# EAGLE schematic canSlaveV06 (EAGLE 7.1.0)

## Sheet 1 of 6
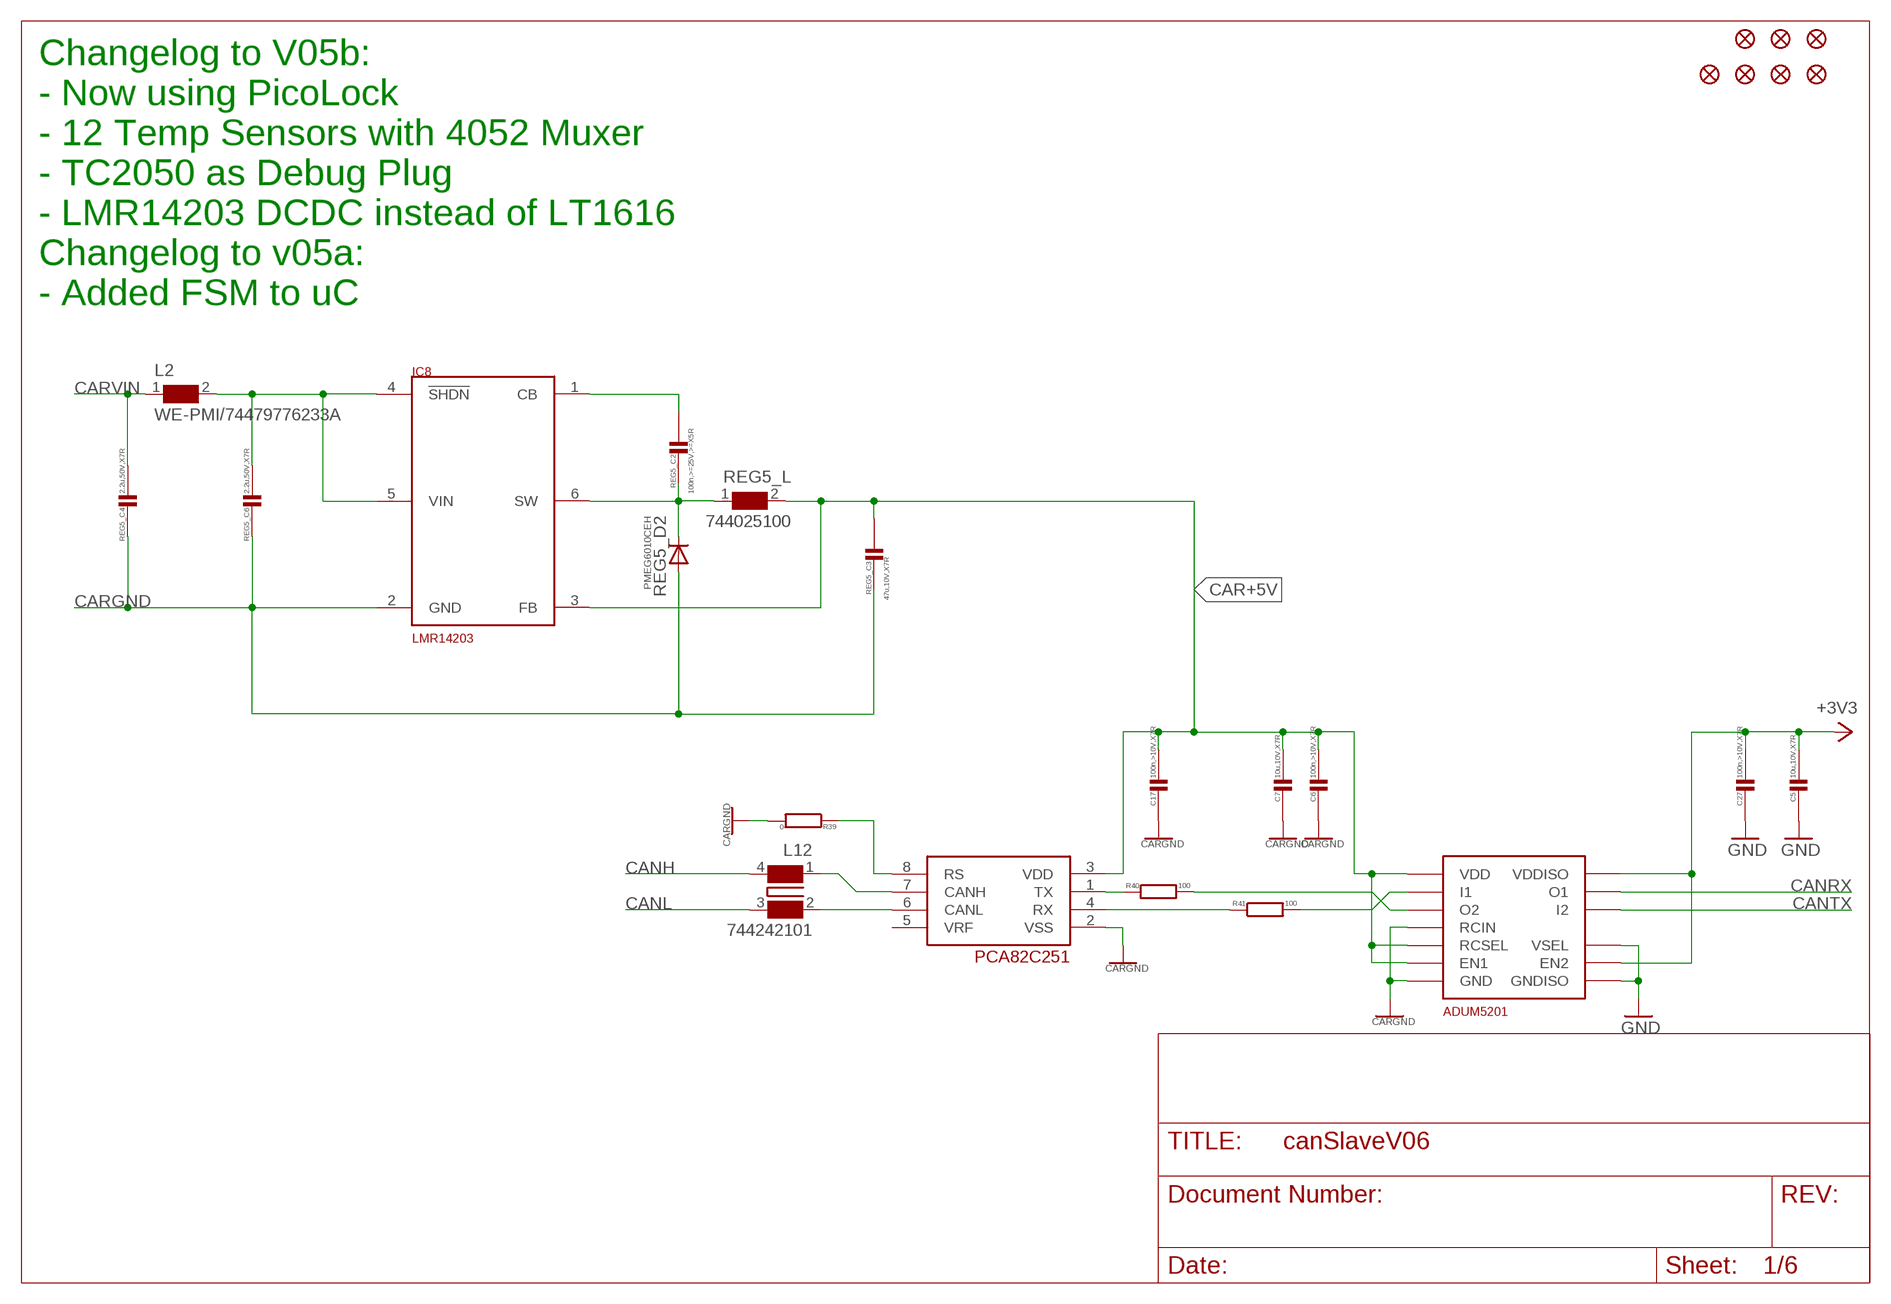
[diagram p0: schematic, sheet 1]

### Parts
C5  10u,10V,X7R  C0603  [C0603]
C6  100n,>10V,X7R  C0402  [C0402]
C7  10u,10V,X7R  C0603  [C0603]
C17  100n,>10V,X7R  C0402  [C0402]
C27  100n,>10V,X7R  C0402  [C0402]
FID2  FIDUCIAL""  [FIDUCIAL_1MM]
FID3  FIDUCIAL""  [FIDUCIAL_1MM]
FID4  FIDUCIAL""  [FIDUCIAL_1MM]
FID7  FIDUCIAL""  [FIDUCIAL_1MM]
FID8  FIDUCIAL""  [FIDUCIAL_1MM]
FID9  FIDUCIAL""  [FIDUCIAL_1MM]
FID10  FIDUCIAL""  [FIDUCIAL_1MM]
IC4  PCA82C251  MCP2551  [SO-8]
IC5  ADUM5201  [SO16WB]
IC8  LMR14203  LMR1420X  [SOT23-6]
L2  WE-PMI/74479776233A  WE-PMI_0806  [WE-PMI_0806]
L12  744242101  WE-SLM  [WE-SLM]
R39  0  R0402  [R0402]
R40  100  R0402  [R0402]
R41  100  R0402  [R0402]
REG5_C2  100n,>=25V,>=X5R  C0402  [C0402]
REG5_C3  47u,10V,X7R  C1210  [C1210]
REG5_C4  2.2u,50V,X7R  C0805  [C0805]
REG5_C6  2.2u,50V,X7R  C0805  [C0805]
REG5_D2  PMEG6010CEH  D-SOD123  [SOD123]
REG5_L  744025100  WE-TPC_2828  [WE-TPC_2828]

### Nets
+3V3: C5.1 C27.1 IC5.P$10(EN2) IC5.P$16(VDDISO) ; also sheet 2,3,6
BOOST1: IC8.1(CB) REG5_C2.1
CANH: L12.4 ; also sheet 5
CANL: L12.3 ; also sheet 5
CANRX: IC5.P$14(O1) ; also sheet 2
CANTX: IC5.P$13(I2) ; also sheet 2
CAR+5V: C6.1 C7.1 C17.1 IC4.3(VDD) IC5.P$1(VDD) IC5.P$6(RCSEL) IC5.P$7(EN1) IC8.3(FB) REG5_C3.1 REG5_L.2
CAR_CANRX: IC5.P$3(I1) R41.2
CAR_CANRX_T: IC4.4(RX) R41.1
CAR_CANTX: IC5.P$4(O2) R40.2
CAR_CANTX_T: IC4.1(TX) R40.1
CARGND: C6.2 C7.2 C17.2 IC4.2(VSS) IC5.P$2(GND) IC5.P$5(RCIN) IC5.P$8(GND) IC8.2(GND) R39.2 REG5_C3.2 REG5_C4.2 REG5_C6.2 REG5_D2.2(A) ; also sheet 5
CARVIN: L2.1 REG5_C4.1 ; also sheet 5
CARVINFILT: IC8.4(!SHDN) IC8.5(VIN) L2.2 REG5_C6.1
GND: C5.2 C27.2 IC5.P$9(GNDISO) IC5.P$11(VSEL) IC5.P$15(GNDISO) ; also sheet 2,3,5,6
N$2: IC4.7(CANH) L12.1
N$6: IC4.6(CANL) L12.2
RS1: IC4.8(RS) R39.1
SW1: IC8.6(SW) REG5_C2.2 REG5_D2.1(C) REG5_L.1
Unconnected: IC4.5(VRF)

### Notes on the sheet
- Changelog to V05b:
  - Now using PicoLock
  - 12 Temp Sensors with 4052 Muxer
  - TC2050 as Debug Plug
  - LMR14203 DCDC instead of LT1616
  Changelog to v05a:
  - Added FSM to uC

## Sheet 2 of 6
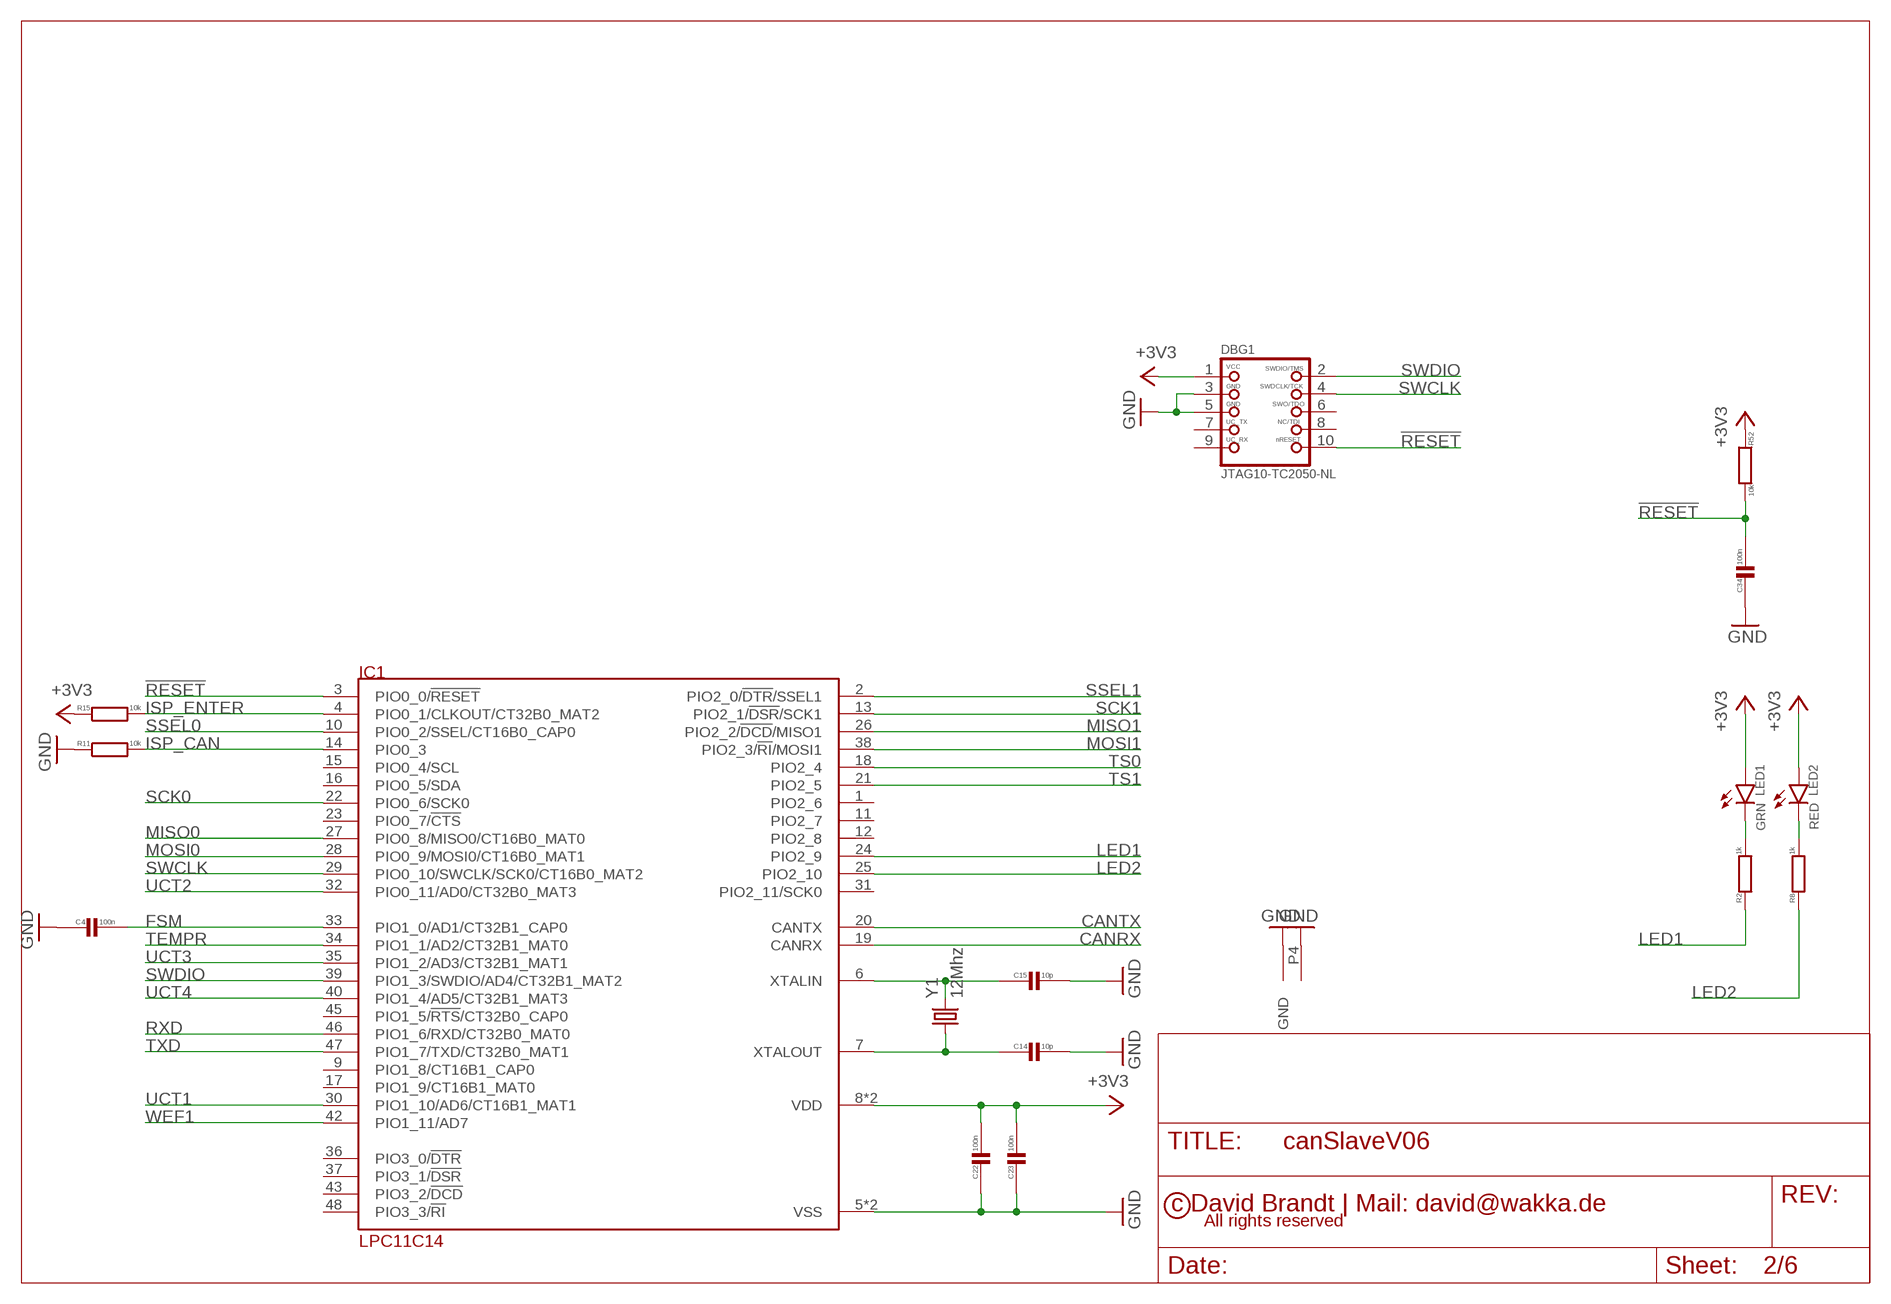
[diagram p1: schematic, sheet 2]

### Parts
C4  100n  C0402  [C0402]
C14  10p  C0402  [C0402]
C15  10p  C0402  [C0402]
C22  100n  C0402  [C0402]
C23  100n  C0402  [C0402]
C34  100n  C0402  [C0402]
DBG1  JTAG10-TC2050-NL  [TC2050-NL-JTORDER]
IC1  LPC11C14  LPC11C1X  [LQFP48]
LED1  GRN  LED0603  [CHIPLED_0603]
LED2  RED  LED0603  [CHIPLED_0603]
R2  1k  R0402  [R0402]
R8  1k  R0402  [R0402]
R11  10k  R0402  [R0402]
R15  10k  R0402  [R0402]
R52  10k  R0402  [R0402]
Y1  12Mhz  CRYSTAL43.2X2.5  [MT]

### Nets
!RESET: C34.1 DBG1.10 IC1.3(PIO0_0/!RESET) R52.2
+3V3: C22.1 C23.1 DBG1.1 IC1.8(VDD) IC1.44(VDD) LED1.A LED2.A R15.1 R52.1 ; also sheet 1,3,6
CANRX: IC1.19(CANRX) ; also sheet 1
CANTX: IC1.20(CANTX) ; also sheet 1
FSM: C4.1 IC1.33(PIO1_0/AD1/CT32B1_CAP0) ; also sheet 3
GND: C4.2 C14.1 C15.1 C22.2 C23.2 C34.2 DBG1.3 DBG1.5 IC1.5(VSS) IC1.41(VSS) R11.1 Y1.P2(GND) Y1.P4(GND1) ; also sheet 1,3,5,6
ISP_CAN: IC1.14(PIO0_3) R11.2
ISP_ENTER: IC1.4(PIO0_1/CLKOUT/CT32B0_MAT2) R15.2
LED1: IC1.24(PIO2_9) R2.1
LED1C: LED1.C R2.2
LED2: IC1.25(PIO2_10) R8.1
LED2C: LED2.C R8.2
MISO0: IC1.27(PIO0_8/MISO0/CT16B0_MAT0) ; also sheet 3
MISO1: IC1.26(PIO2_2/!DCD!/MISO1)
MOSI0: IC1.28(PIO0_9/MOSI0/CT16B0_MAT1) ; also sheet 3
MOSI1: IC1.38(PIO2_3/!RI!/MOSI1)
RXD: IC1.46(PIO1_6/RXD/CT32B0_MAT0)
SCK0: IC1.22(PIO0_6/SCK0) ; also sheet 3
SCK1: IC1.13(PIO2_1/!DSR!/SCK1)
SSEL0: IC1.10(PIO0_2/SSEL/CT16B0_CAP0) ; also sheet 3
SSEL1: IC1.2(PIO2_0/!DTR!/SSEL1)
SWCLK: DBG1.4 IC1.29(PIO0_10/SWCLK/SCK0/CT16B0_MAT2)
SWDIO: DBG1.2 IC1.39(PIO1_3/SWDIO/AD4/CT32B1_MAT2)
TEMPR: IC1.34(PIO1_1/AD2/CT32B1_MAT0) ; also sheet 3
TS0: IC1.18(PIO2_4) ; also sheet 6
TS1: IC1.21(PIO2_5) ; also sheet 6
TXD: IC1.47(PIO1_7/TXD/CT32B0_MAT1)
UCT1: IC1.30(PIO1_10/AD6/CT16B1_MAT1) ; also sheet 6
UCT2: IC1.32(PIO0_11/AD0/CT32B0_MAT3) ; also sheet 6
UCT3: IC1.35(PIO1_2/AD3/CT32B1_MAT1) ; also sheet 6
UCT4: IC1.40(PIO1_4/AD5/CT32B1_MAT3) ; also sheet 6
WEF1: IC1.42(PIO1_11/AD7)
XTALIN: C15.2 IC1.6(XTALIN) Y1.P3
XTALOUT: C14.2 IC1.7(XTALOUT) Y1.P1
Unconnected: DBG1.6 DBG1.7 DBG1.8 DBG1.9 IC1.1(PIO2_6) IC1.9(PIO1_8/CT16B1_CAP0) IC1.11(PIO2_7) IC1.12(PIO2_8) IC1.15(PIO0_4/SCL) IC1.16(PIO0_5/SDA) IC1.17(PIO1_9/CT16B1_MAT0) IC1.23(PIO0_7/!CTS) IC1.31(PIO2_11/SCK0) IC1.36(PIO3_0/!DTR) IC1.37(PIO3_1/!DSR) IC1.43(PIO3_2/!DCD) IC1.45(PIO1_5/!RTS!/CT32B0_CAP0) IC1.48(PIO3_3/!RI)

## Sheet 3 of 6
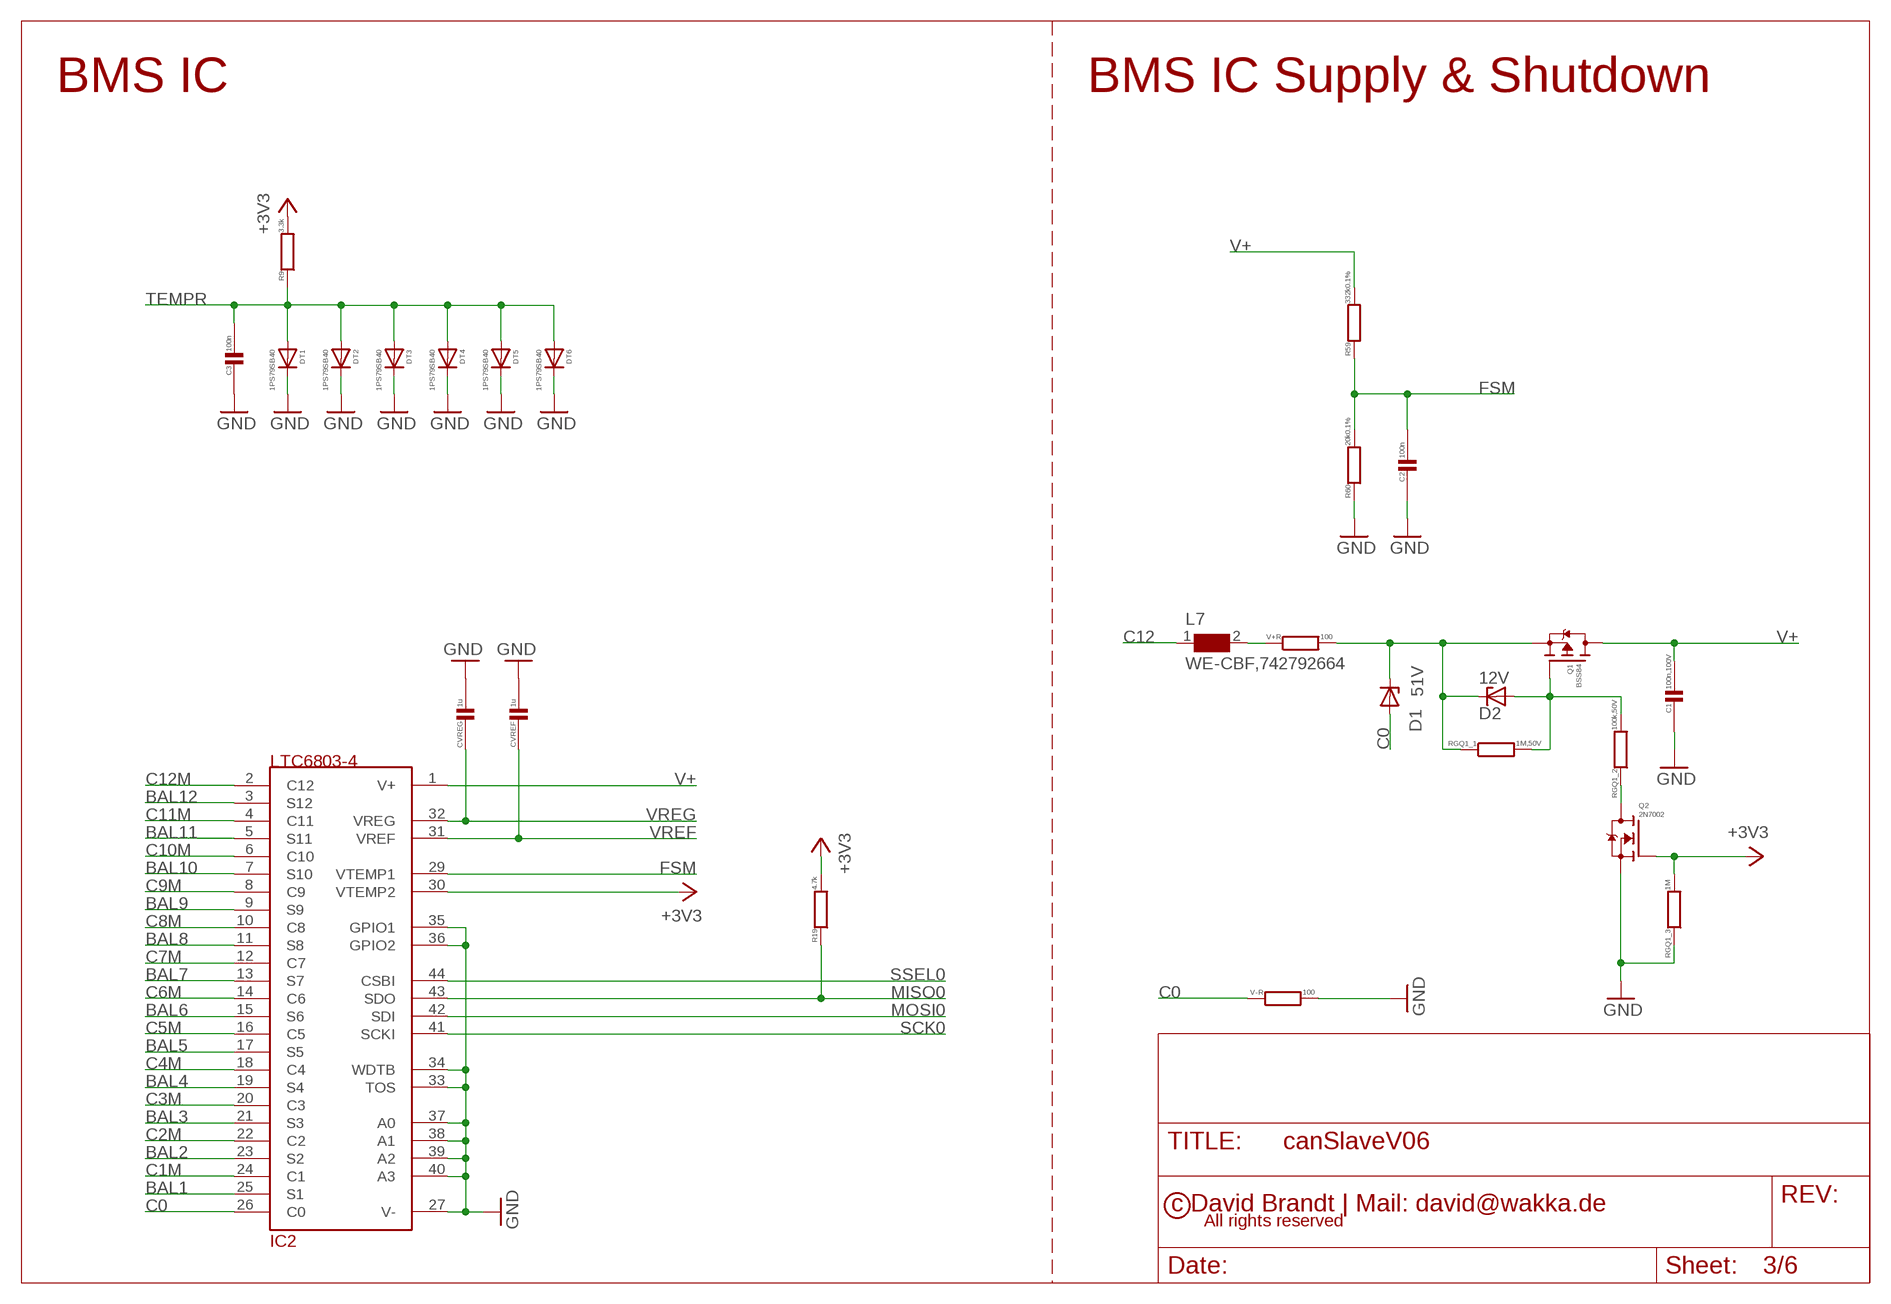
[diagram p2: schematic, sheet 3]

### Parts
C1  100n,100V  C0603  [C0603]
C2  100n  C0402  [C0402]
C3  100n  C0402  [C0402]
CVREF  1u  C0402  [C0402]
CVREG  1u  C0402  [C0402]
D1  51V  ZENERSOD323  [SOD323-L]
D2  12V  ZENERSOD323  [SOD323-L]
DT1  1PS79SB40  DIODE-SOD523  [SOD523]
DT2  1PS79SB40  DIODE-SOD523  [SOD523]
DT3  1PS79SB40  DIODE-SOD523  [SOD523]
DT4  1PS79SB40  DIODE-SOD523  [SOD523]
DT5  1PS79SB40  DIODE-SOD523  [SOD523]
DT6  1PS79SB40  DIODE-SOD523  [SOD523]
IC2  LTC6803-4  [44SSOP]
L7  WE-CBF,742792664  WE-CBF_0603  [0603]
Q1  BSS84  [SOT23]
Q2  2N7002  [SOT23]
R9  3.3k  R0603  [R0603]
R19  4.7k  R0402  [R0402]
R59  332k0.1%  R0603  [R0603]
R60  20k0.1%  R0402  [R0402]
RGQ1_1  1M,50V  R0603  [R0603]
RGQ1_2  100k,50V  R0603  [R0603]
RGQ1_3  1M  R0402  [R0402]
V+R  100  R0603  [R0603]
V-R  100  R0603  [R0603]

### Nets
+3V3: IC2.30(VTEMP2) Q2.1(G) R9.2 R19.2 RGQ1_3.2 ; also sheet 1,2,6
BAL1: IC2.25(S1) ; also sheet 4
BAL2: IC2.23(S2) ; also sheet 4
BAL3: IC2.21(S3) ; also sheet 4
BAL4: IC2.19(S4) ; also sheet 4
BAL5: IC2.17(S5) ; also sheet 4
BAL6: IC2.15(S6) ; also sheet 4
BAL7: IC2.13(S7) ; also sheet 4
BAL8: IC2.11(S8) ; also sheet 4
BAL9: IC2.9(S9) ; also sheet 4
BAL10: IC2.7(S10) ; also sheet 4
BAL11: IC2.5(S11) ; also sheet 4
BAL12: IC2.3(S12) ; also sheet 4
C0: D1.A IC2.26(C0) V-R.1 ; also sheet 4,5
C1M: IC2.24(C1) ; also sheet 4
C2M: IC2.22(C2) ; also sheet 4
C3M: IC2.20(C3) ; also sheet 4
C4M: IC2.18(C4) ; also sheet 4
C5M: IC2.16(C5) ; also sheet 4
C6M: IC2.14(C6) ; also sheet 4
C7M: IC2.12(C7) ; also sheet 4
C8M: IC2.10(C8) ; also sheet 4
C9M: IC2.8(C9) ; also sheet 4
C10M: IC2.6(C10) ; also sheet 4
C11M: IC2.4(C11) ; also sheet 4
C12: L7.1 ; also sheet 4,5
C12FILT: L7.2 V+R.1
C12M: IC2.2(C12) ; also sheet 4
FSM: C2.1 IC2.29(VTEMP1) R59.1 R60.2 ; also sheet 2
GND: C1.2 C2.2 C3.2 CVREF.1 CVREG.1 DT1.C DT2.C DT3.C DT4.C DT5.C DT6.C IC2.27(V-) IC2.33(TOS) IC2.34(WDTB) IC2.35(GPIO1) IC2.36(GPIO2) IC2.37(A0) IC2.38(A1) IC2.39(A2) IC2.40(A3) Q2.2(S) R60.1 RGQ1_3.1 V-R.2 ; also sheet 1,2,5,6
MISO0: IC2.43(SDO) R19.1 ; also sheet 2
MOSI0: IC2.42(SDI) ; also sheet 2
Q1G: D2.A Q1.1(G) RGQ1_1.2 RGQ1_2.2
Q1GR: Q2.3(D) RGQ1_2.1
SCK0: IC2.41(SCKI) ; also sheet 2
SSEL0: IC2.44(CSBI) ; also sheet 2
TEMPR: C3.1 DT1.A DT2.A DT3.A DT4.A DT5.A DT6.A R9.1 ; also sheet 2
V+: C1.1 IC2.1(V+) Q1.3(D) R59.2
V+S: D1.C D2.C Q1.2(S) RGQ1_1.1 V+R.2
VREF: CVREF.2 IC2.31(VREF)
VREG: CVREG.2 IC2.32(VREG)

### Notes on the sheet
- BMS IC | BMS IC Supply & Shutdown

## Sheet 4 of 6
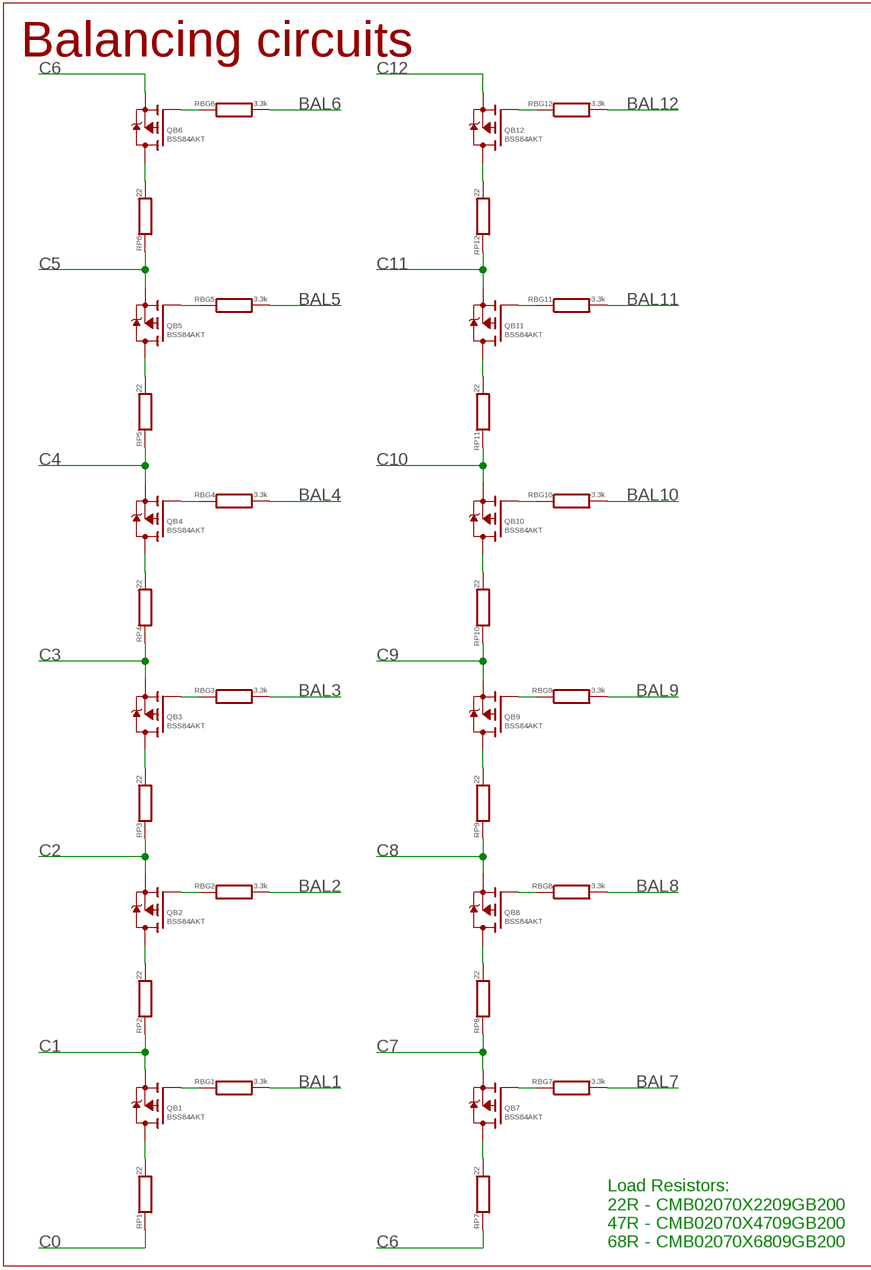
[diagram p3: schematic, sheet 4, part 1 of 2]
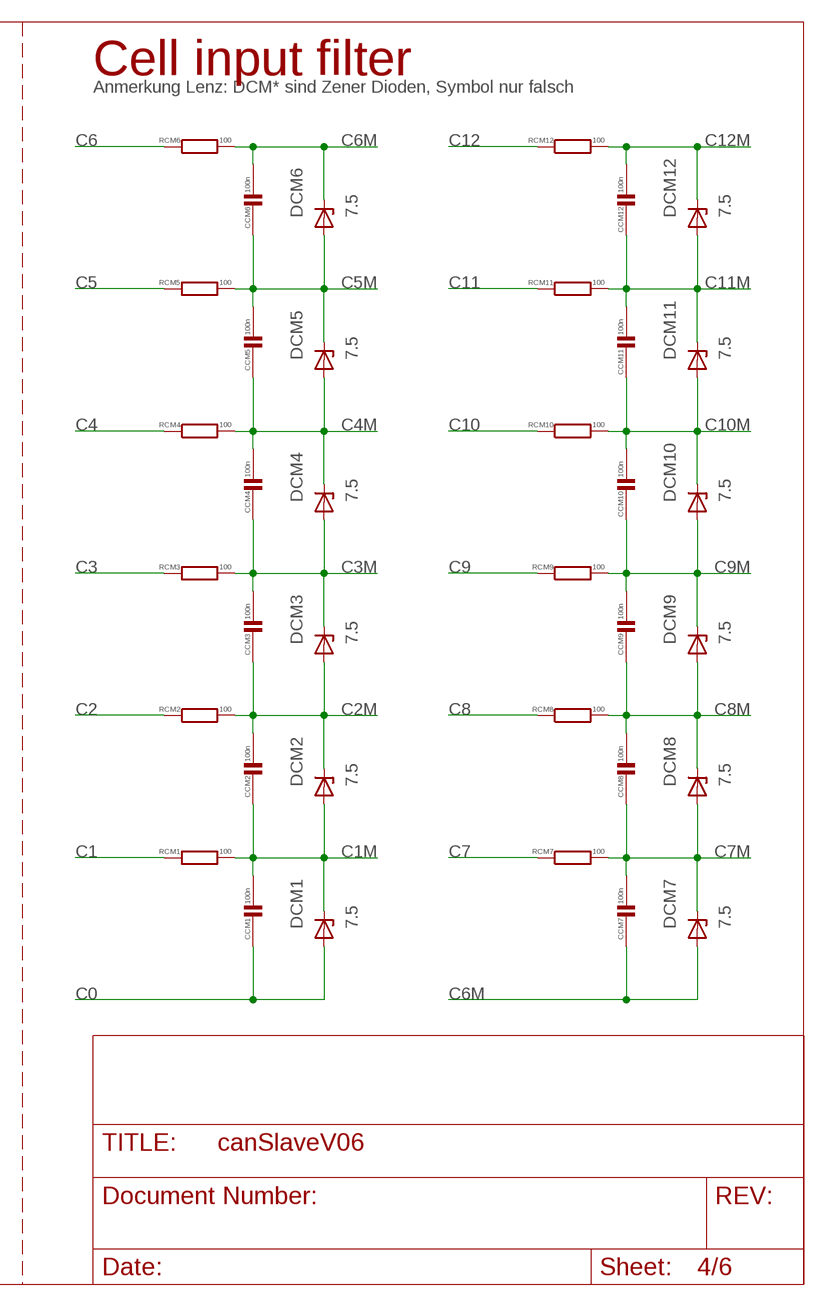
[diagram p4: schematic, sheet 4, part 2 of 2]

### Parts
CCM1  100n  C0402  [C0402]
CCM2  100n  C0402  [C0402]
CCM3  100n  C0402  [C0402]
CCM4  100n  C0402  [C0402]
CCM5  100n  C0402  [C0402]
CCM6  100n  C0402  [C0402]
CCM7  100n  C0402  [C0402]
CCM8  100n  C0402  [C0402]
CCM9  100n  C0402  [C0402]
CCM10  100n  C0402  [C0402]
CCM11  100n  C0402  [C0402]
CCM12  100n  C0402  [C0402]
DCM1  7.5  ZENERSOD523  [SOD523]
DCM2  7.5  ZENERSOD523  [SOD523]
DCM3  7.5  ZENERSOD523  [SOD523]
DCM4  7.5  ZENERSOD523  [SOD523]
DCM5  7.5  ZENERSOD523  [SOD523]
DCM6  7.5  ZENERSOD523  [SOD523]
DCM7  7.5  ZENERSOD523  [SOD523]
DCM8  7.5  ZENERSOD523  [SOD523]
DCM9  7.5  ZENERSOD523  [SOD523]
DCM10  7.5  ZENERSOD523  [SOD523]
DCM11  7.5  ZENERSOD523  [SOD523]
DCM12  7.5  ZENERSOD523  [SOD523]
QB1  BSS84AKT  [SOT416]
QB2  BSS84AKT  [SOT416]
QB3  BSS84AKT  [SOT416]
QB4  BSS84AKT  [SOT416]
QB5  BSS84AKT  [SOT416]
QB6  BSS84AKT  [SOT416]
QB7  BSS84AKT  [SOT416]
QB8  BSS84AKT  [SOT416]
QB9  BSS84AKT  [SOT416]
QB10  BSS84AKT  [SOT416]
QB11  BSS84AKT  [SOT416]
QB12  BSS84AKT  [SOT416]
RBG1  3.3k  R0402  [R0402]
RBG2  3.3k  R0402  [R0402]
RBG3  3.3k  R0402  [R0402]
RBG4  3.3k  R0402  [R0402]
RBG5  3.3k  R0402  [R0402]
RBG6  3.3k  R0402  [R0402]
RBG7  3.3k  R0402  [R0402]
RBG8  3.3k  R0402  [R0402]
RBG9  3.3k  R0402  [R0402]
RBG10  3.3k  R0402  [R0402]
RBG11  3.3k  R0402  [R0402]
RBG12  3.3k  R0402  [R0402]
RCM1  100  R0402  [R0402]
RCM2  100  R0402  [R0402]
RCM3  100  R0402  [R0402]
RCM4  100  R0402  [R0402]
RCM5  100  R0402  [R0402]
RCM6  100  R0402  [R0402]
RCM7  100  R0402  [R0402]
RCM8  100  R0402  [R0402]
RCM9  100  R0402  [R0402]
RCM10  100  R0402  [R0402]
RCM11  100  R0402  [R0402]
RCM12  100  R0402  [R0402]
RP1  22  RMELF-0207R  [MINI_MELF-0207R]
RP2  22  RMELF-0207R  [MINI_MELF-0207R]
RP3  22  RMELF-0207R  [MINI_MELF-0207R]
RP4  22  RMELF-0207R  [MINI_MELF-0207R]
RP5  22  RMELF-0207R  [MINI_MELF-0207R]
RP6  22  RMELF-0207R  [MINI_MELF-0207R]
RP7  22  RMELF-0207R  [MINI_MELF-0207R]
RP8  22  RMELF-0207R  [MINI_MELF-0207R]
RP9  22  RMELF-0207R  [MINI_MELF-0207R]
RP10  22  RMELF-0207R  [MINI_MELF-0207R]
RP11  22  RMELF-0207R  [MINI_MELF-0207R]
RP12  22  RMELF-0207R  [MINI_MELF-0207R]

### Nets
BAL1: RBG1.2 ; also sheet 3
BAL2: RBG2.2 ; also sheet 3
BAL3: RBG3.2 ; also sheet 3
BAL4: RBG4.2 ; also sheet 3
BAL5: RBG5.2 ; also sheet 3
BAL6: RBG6.2 ; also sheet 3
BAL7: RBG7.2 ; also sheet 3
BAL8: RBG8.2 ; also sheet 3
BAL9: RBG9.2 ; also sheet 3
BAL10: RBG10.2 ; also sheet 3
BAL11: RBG11.2 ; also sheet 3
BAL12: RBG12.2 ; also sheet 3
C0: CCM1.2 DCM1.A RP1.1 ; also sheet 3,5
C1: QB1.2(S) RCM1.1 RP2.1 ; also sheet 5
C1M: CCM1.1 CCM2.2 DCM1.C DCM2.A RCM1.2 ; also sheet 3
C2: QB2.2(S) RCM2.1 RP3.1 ; also sheet 5
C2M: CCM2.1 CCM3.2 DCM2.C DCM3.A RCM2.2 ; also sheet 3
C3: QB3.2(S) RCM3.1 RP4.1 ; also sheet 5
C3M: CCM3.1 CCM4.2 DCM3.C DCM4.A RCM3.2 ; also sheet 3
C4: QB4.2(S) RCM4.1 RP5.1 ; also sheet 5
C4M: CCM4.1 CCM5.2 DCM4.C DCM5.A RCM4.2 ; also sheet 3
C5: QB5.2(S) RCM5.1 RP6.1 ; also sheet 5
C5M: CCM5.1 CCM6.2 DCM5.C DCM6.A RCM5.2 ; also sheet 3
C6: QB6.2(S) RCM6.1 RP7.1 ; also sheet 5
C6M: CCM6.1 CCM7.2 DCM6.C DCM7.A RCM6.2 ; also sheet 3
C7: QB7.2(S) RCM7.1 RP8.1 ; also sheet 5
C7M: CCM7.1 CCM8.2 DCM7.C DCM8.A RCM7.2 ; also sheet 3
C8: QB8.2(S) RCM8.1 RP9.1 ; also sheet 5
C8M: CCM8.1 CCM9.2 DCM8.C DCM9.A RCM8.2 ; also sheet 3
C9: QB9.2(S) RCM9.1 RP10.1 ; also sheet 5
C9M: CCM9.1 CCM10.2 DCM9.C DCM10.A RCM9.2 ; also sheet 3
C10: QB10.2(S) RCM10.1 RP11.1 ; also sheet 5
C10M: CCM10.1 CCM11.2 DCM10.C DCM11.A RCM10.2 ; also sheet 3
C11: QB11.2(S) RCM11.1 RP12.1 ; also sheet 5
C11M: CCM11.1 CCM12.2 DCM11.C DCM12.A RCM11.2 ; also sheet 3
C12: QB12.2(S) RCM12.1 ; also sheet 3,5
C12M: CCM12.1 DCM12.C RCM12.2 ; also sheet 3
CR1: QB1.3(D) RP1.2
CR2: QB2.3(D) RP2.2
CR3: QB3.3(D) RP3.2
CR4: QB4.3(D) RP4.2
CR5: QB5.3(D) RP5.2
CR6: QB6.3(D) RP6.2
CR7: QB7.3(D) RP7.2
CR8: QB8.3(D) RP8.2
CR9: QB9.3(D) RP9.2
CR10: QB10.3(D) RP10.2
CR11: QB11.3(D) RP11.2
CR12: QB12.3(D) RP12.2
QBG1: QB1.1(G) RBG1.1
QBG2: QB2.1(G) RBG2.1
QBG3: QB3.1(G) RBG3.1
QBG4: QB4.1(G) RBG4.1
QBG5: QB5.1(G) RBG5.1
QBG6: QB6.1(G) RBG6.1
QBG7: QB7.1(G) RBG7.1
QBG8: QB8.1(G) RBG8.1
QBG9: QB9.1(G) RBG9.1
QBG10: QB10.1(G) RBG10.1
QBG11: QB11.1(G) RBG11.1
QBG12: QB12.1(G) RBG12.1

### Notes on the sheet
- Balancing circuits | Cell input filter
- Anmerkung Lenz: DCM* sind Zener Dioden, Symbol nur falsch
- Load Resistors:
  22R - CMB02070X2209GB200 
  47R - CMB02070X4709GB200 
  68R - CMB02070X6809GB200

## Sheet 5 of 6
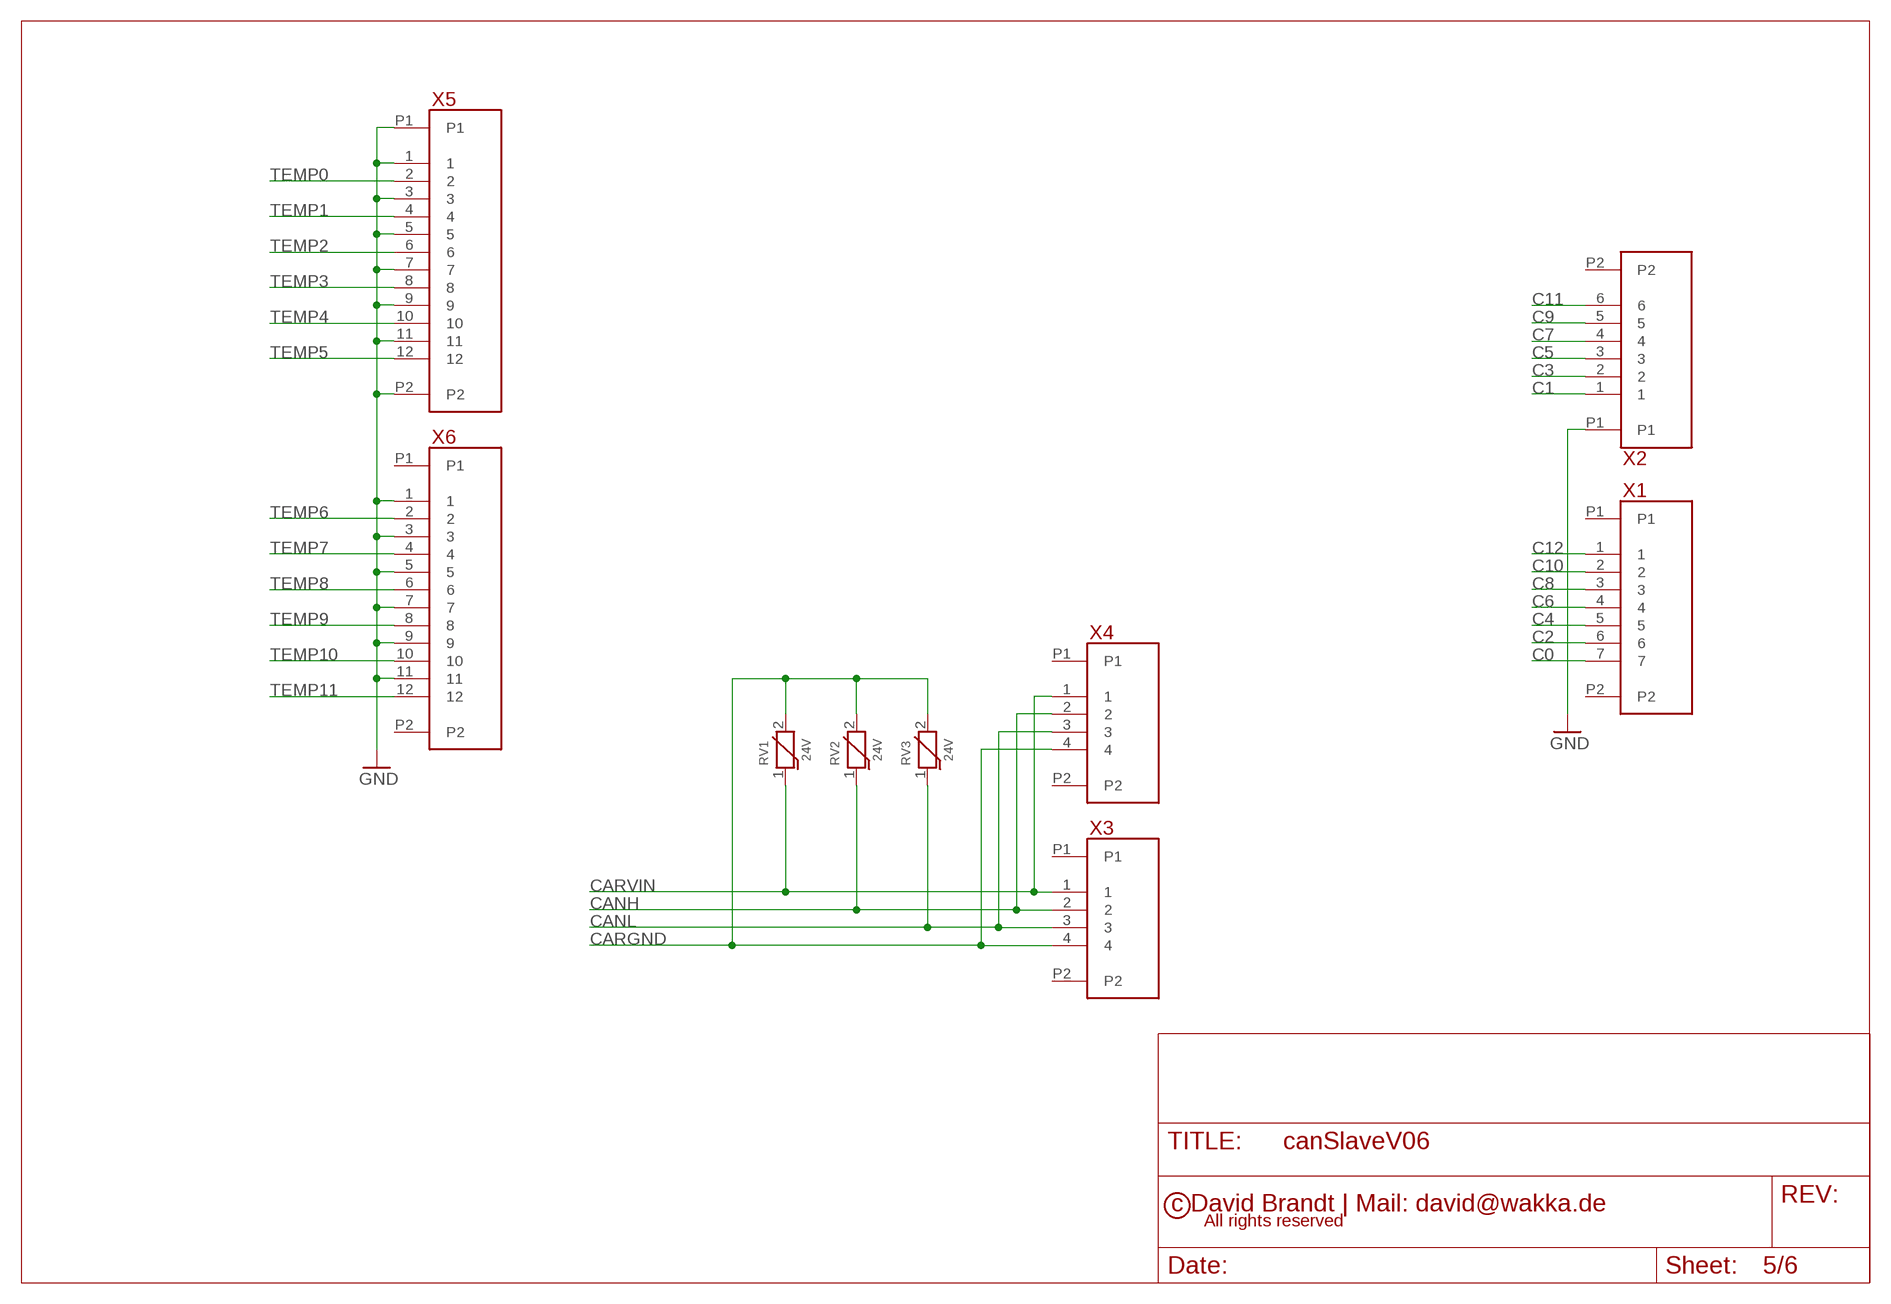
[diagram p5: schematic, sheet 5]

### Parts
RV1  24V  VARISTOR0603  [R0603]
RV2  24V  VARISTOR0603  [R0603]
RV3  24V  VARISTOR0603  [R0603]
X1  504050-0791  [504050-0791]
X2  504050-0691  [504050-0691]
X3  504050-0491  [504050-0491]
X4  504050-0491  [504050-0491]
X5  504050-1291  [504050-1291]
X6  504050-1291  [504050-1291]

### Nets
C0: X1.7 ; also sheet 3,4
C1: X2.1 ; also sheet 4
C2: X1.6 ; also sheet 4
C3: X2.2 ; also sheet 4
C4: X1.5 ; also sheet 4
C5: X2.3 ; also sheet 4
C6: X1.4 ; also sheet 4
C7: X2.4 ; also sheet 4
C8: X1.3 ; also sheet 4
C9: X2.5 ; also sheet 4
C10: X1.2 ; also sheet 4
C11: X2.6 ; also sheet 4
C12: X1.1 ; also sheet 3,4
CANH: RV2.1 X3.2 X4.2 ; also sheet 1
CANL: RV3.1 X3.3 X4.3 ; also sheet 1
CARGND: RV1.2 RV2.2 RV3.2 X3.4 X4.4 ; also sheet 1
CARVIN: RV1.1 X3.1 X4.1 ; also sheet 1
GND: X2.P1 X5.1 X5.3 X5.5 X5.7 X5.9 X5.11 X5.P1 X5.P2 X6.1 X6.3 X6.5 X6.7 X6.9 X6.11 ; also sheet 1,2,3,6
TEMP0: X5.2 ; also sheet 6
TEMP1: X5.4 ; also sheet 6
TEMP2: X5.6 ; also sheet 6
TEMP3: X5.8 ; also sheet 6
TEMP4: X5.10 ; also sheet 6
TEMP5: X5.12 ; also sheet 6
TEMP6: X6.2 ; also sheet 6
TEMP7: X6.4 ; also sheet 6
TEMP8: X6.6 ; also sheet 6
TEMP9: X6.8 ; also sheet 6
TEMP10: X6.10 ; also sheet 6
TEMP11: X6.12 ; also sheet 6
Unconnected: X1.P1 X1.P2 X2.P2 X3.P1 X3.P2 X4.P1 X4.P2 X6.P1 X6.P2

## Sheet 6 of 6
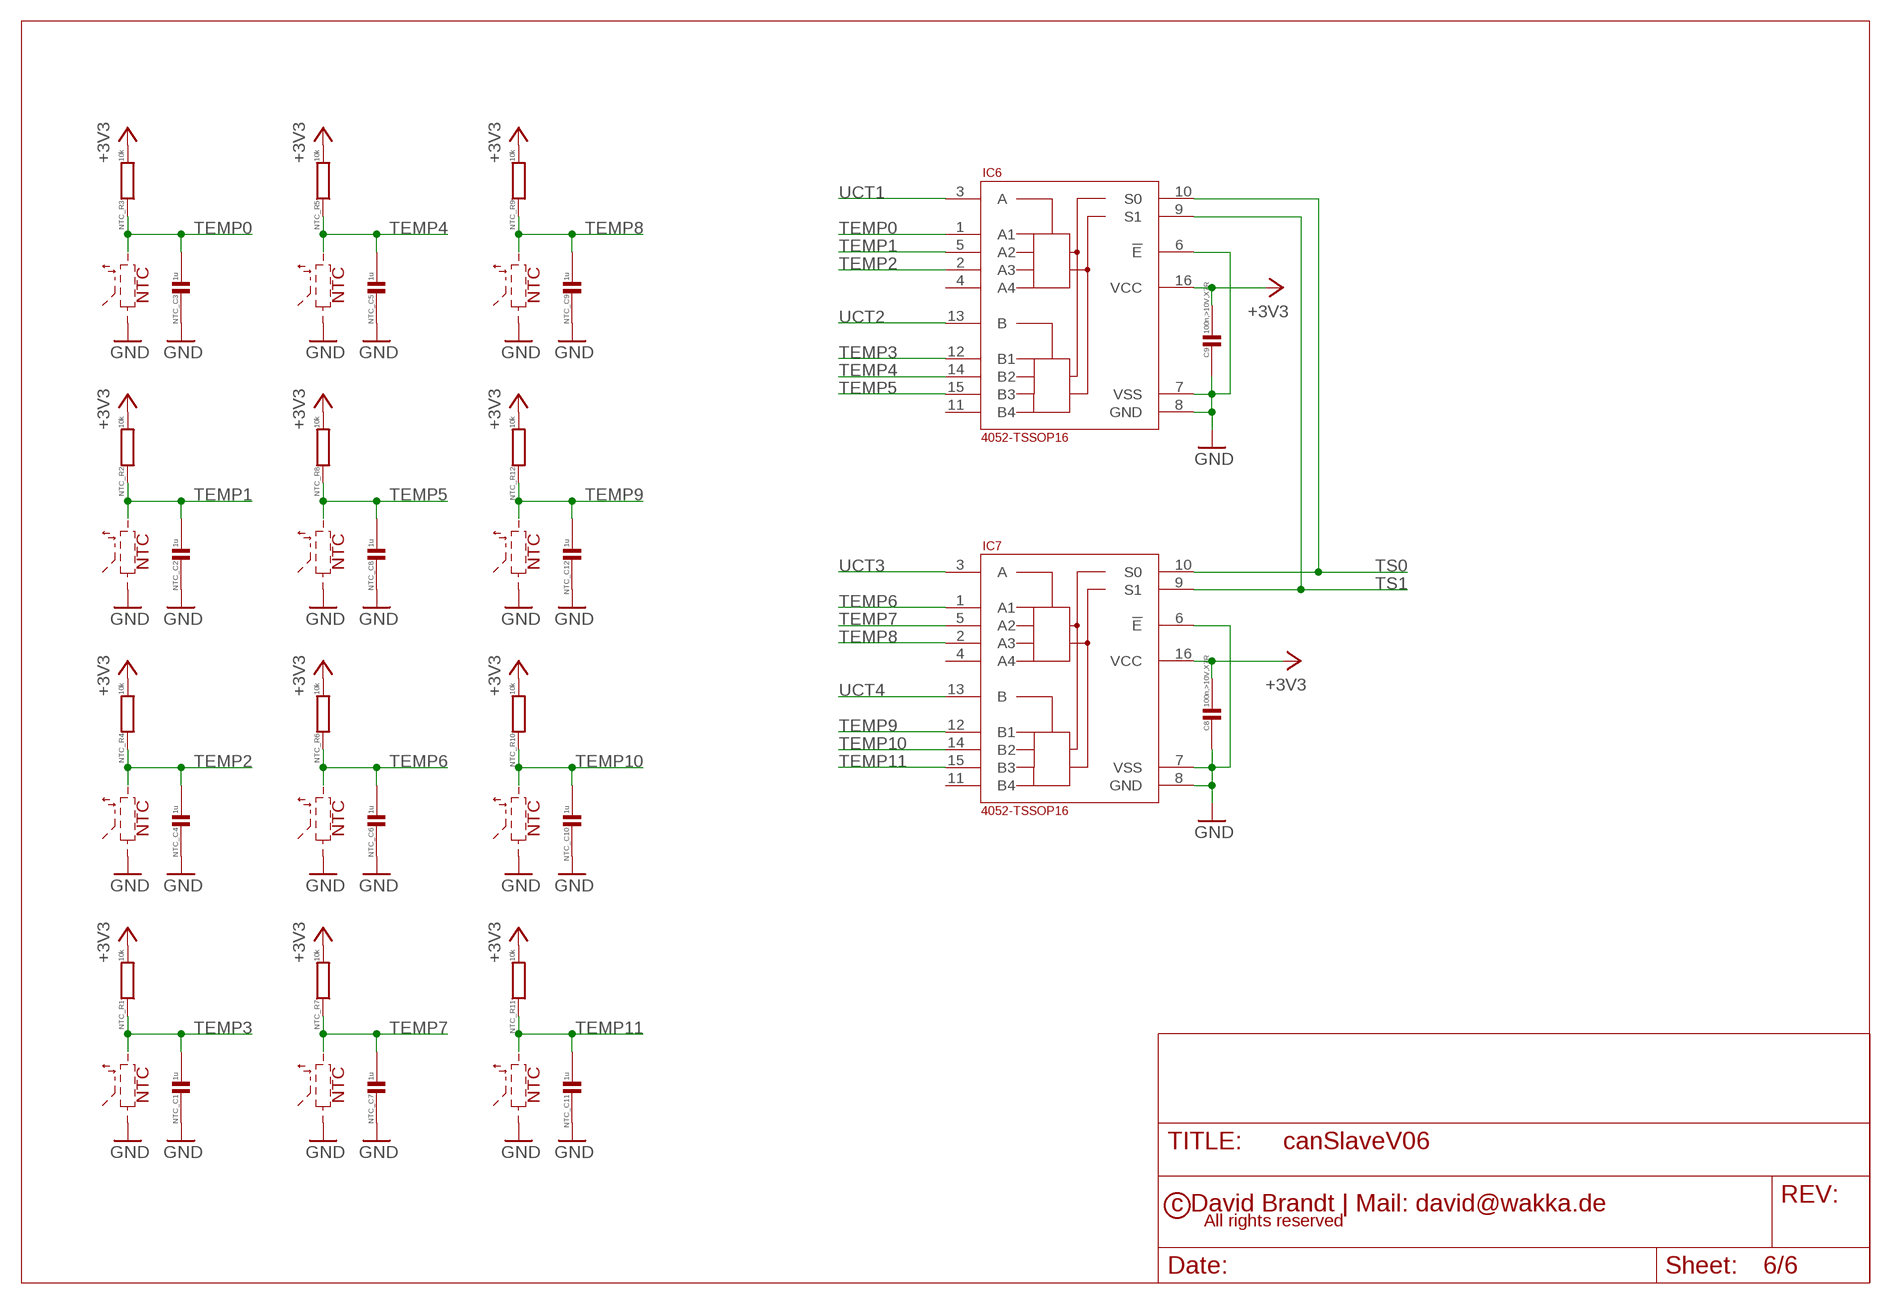
[diagram p6: schematic, sheet 6]

### Parts
C8  100n,>10V,X7R  C0402  [C0402]
C9  100n,>10V,X7R  C0402  [C0402]
IC6  4052-TSSOP16  [TSSOP16]
IC7  4052-TSSOP16  [TSSOP16]
NTC_C1  1u  C0402  [C0402]
NTC_C2  1u  C0402  [C0402]
NTC_C3  1u  C0402  [C0402]
NTC_C4  1u  C0402  [C0402]
NTC_C5  1u  C0402  [C0402]
NTC_C6  1u  C0402  [C0402]
NTC_C7  1u  C0402  [C0402]
NTC_C8  1u  C0402  [C0402]
NTC_C9  1u  C0402  [C0402]
NTC_C10  1u  C0402  [C0402]
NTC_C11  1u  C0402  [C0402]
NTC_C12  1u  C0402  [C0402]
NTC_R1  10k  R0402  [R0402]
NTC_R2  10k  R0402  [R0402]
NTC_R3  10k  R0402  [R0402]
NTC_R4  10k  R0402  [R0402]
NTC_R5  10k  R0402  [R0402]
NTC_R6  10k  R0402  [R0402]
NTC_R7  10k  R0402  [R0402]
NTC_R8  10k  R0402  [R0402]
NTC_R9  10k  R0402  [R0402]
NTC_R10  10k  R0402  [R0402]
NTC_R11  10k  R0402  [R0402]
NTC_R12  10k  R0402  [R0402]

### Nets
+3V3: C8.1 C9.1 IC6.16(VCC) IC7.16(VCC) NTC_R1.2 NTC_R2.2 NTC_R3.2 NTC_R4.2 NTC_R5.2 NTC_R6.2 NTC_R7.2 NTC_R8.2 NTC_R9.2 NTC_R10.2 NTC_R11.2 NTC_R12.2 ; also sheet 1,2,3
GND: C8.2 C9.2 IC6.6(!E) IC6.7(VSS) IC6.8(GND) IC7.6(!E) IC7.7(VSS) IC7.8(GND) NTC_C1.2 NTC_C2.2 NTC_C3.2 NTC_C4.2 NTC_C5.2 NTC_C6.2 NTC_C7.2 NTC_C8.2 NTC_C9.2 NTC_C10.2 NTC_C11.2 NTC_C12.2 ; also sheet 1,2,3,5
TEMP0: IC6.1(A1) NTC_C3.1 NTC_R3.1 ; also sheet 5
TEMP1: IC6.5(A2) NTC_C2.1 NTC_R2.1 ; also sheet 5
TEMP2: IC6.2(A3) NTC_C4.1 NTC_R4.1 ; also sheet 5
TEMP3: IC6.12(B1) NTC_C1.1 NTC_R1.1 ; also sheet 5
TEMP4: IC6.14(B2) NTC_C5.1 NTC_R5.1 ; also sheet 5
TEMP5: IC6.15(B3) NTC_C8.1 NTC_R8.1 ; also sheet 5
TEMP6: IC7.1(A1) NTC_C6.1 NTC_R6.1 ; also sheet 5
TEMP7: IC7.5(A2) NTC_C7.1 NTC_R7.1 ; also sheet 5
TEMP8: IC7.2(A3) NTC_C9.1 NTC_R9.1 ; also sheet 5
TEMP9: IC7.12(B1) NTC_C12.1 NTC_R12.1 ; also sheet 5
TEMP10: IC7.14(B2) NTC_C10.1 NTC_R10.1 ; also sheet 5
TEMP11: IC7.15(B3) NTC_C11.1 NTC_R11.1 ; also sheet 5
TS0: IC6.10(S0) IC7.10(S0) ; also sheet 2
TS1: IC6.9(S1) IC7.9(S1) ; also sheet 2
UCT1: IC6.3(A) ; also sheet 2
UCT2: IC6.13(B) ; also sheet 2
UCT3: IC7.3(A) ; also sheet 2
UCT4: IC7.13(B) ; also sheet 2
Unconnected: IC6.4(A4) IC6.11(B4) IC7.4(A4) IC7.11(B4)

### Notes on the sheet
- NTC | NTC | NTC
- NTC | NTC | NTC
- NTC | NTC | NTC
- NTC | NTC | NTC

## Library data of the parts
C1-C9 C14 C15 C17 C22 C23 C27 C34 CCM1-CCM12 CVREF CVREG NTC_C1-NTC_C12 REG5_C2-REG5_C4 REG5_C6 = phrenetic:C
D1 D2 DCM1-DCM12 = phrenetic:ZENER
DBG1 = phrenetic:JTAG10
DT1-DT6 = phrenetic:DIODE-: DIODE
FID2-FID4 FID7-FID10 = microbuilder:FIDUCIAL: Fiducial Alignment Points Various fiducial points for machine vision alignment.
IC1 = phrenetic:LPC11C1X
IC2 = bms-hsrm:LTC6803-4
IC4 = bms-hsrm:MCP2551
IC5 = phrenetic:ADUM5201
IC6 IC7 = phrenetic:4052
IC8 = phrenetic:LMR1420X
L2 = EagleLibrary_Wuerth_Elektronik_eiSos_Version_6:WE-PMI: Power Multilayer Inductor WE-PMI - Compact multilayer type - Suitable for applocations with high currents up to 2.5 A - No crosstalk -- DC / DC converters especially at high switching frequencies -- Portable devices like PDA and digital cameras
L7 = EagleLibrary_Wuerth_Elektronik_eiSos_Version_6:WE-CBF: SMD EMI Suppression Ferrite Beads WE-CBF - Excellent anti-EMI properties - Low DC-restistance - Impedances till 3000 ohms - Rated current up to 6 A -- Reliable Ni-Sn electrodes -- Perfect as data lined filter and for uncoupling of distribution voltage
L12 = EagleLibrary_Wuerth_Elektronik_eiSos_Version_6:WE-SLM: SMD Common Mode Line Filter WE-SLM - Small size - Low Profile - High Impedance - High current capability up to 300 mA -- USB -- CAN -- Firewire -- Data Lines -- Power supply systems -- Signal Lines
LED1 LED2 = phrenetic:LED
NTC_R1-NTC_R12 R2 R8 R9 R11 R15 R19 R39-R41 R52 R59 R60 RBG1-RBG12 RCM1-RCM12 RGQ1_1-RGQ1_3 RP1-RP12 V+R V-R = phrenetic:R: RESISTOR, Bla
Q1 QB1-QB12 = phrenetic:BSS84
Q2 = phrenetic:2N7002
REG5_D2 = semicon-smd-ipc:D-: DIODE unfilled
REG5_L = EagleLibrary_Wuerth_Elektronik_eiSos_Version_6:WE-TPC: Shielded Tiny Power Inductor WE-TPC - Extremely flat power inductor - High current capability - High reliability and perfect soldering characteristics because of integrated soldering pad - magnetically shielded -- Portable power like PDA, digital camera, PCMICA-cards and displays -- DC/DC-converter -- Recommended for switching regulator IC's from Linear Technology, National Semiconductor, Texas Instruments and Fairchild Semiconductor
RV1-RV3 = phrenetic:VARISTOR
X1 = con-molex-picolock:504050-0791
X2 = con-molex-picolock:504050-0691
X3 X4 = con-molex-picolock:504050-0491
X5 X6 = con-molex-picolock:504050-1291
Y1 = phrenetic:CRYSTAL4